# Altium schematic sheet FPGA&CODECS.SchDoc: {Наименование}
size 420 x 297 mm; DocumentNumber: ПЛАС.ХХХХХХ.ХХХ ХХ; SheetNumber: 8; SheetTotal: 11; PageSetup: Record=PageOptions|CenterHorizontal=False|CenterVertical=False|PrintScale=0.95|XCorrection=0.00|YCorrection=0.00|PrintKind=1|BorderSize=5000000|LeftOffset=0|BottomOffset=0|Orientation=1|PaperLength=1000|PaperWidth=1000|Scale=100|PaperSource=15|PrintQuality=600|MediaType=1|DitherType=10|PaperKind=A4|PrintScaleMode=1; Rule: PcbType=ProtelPcb
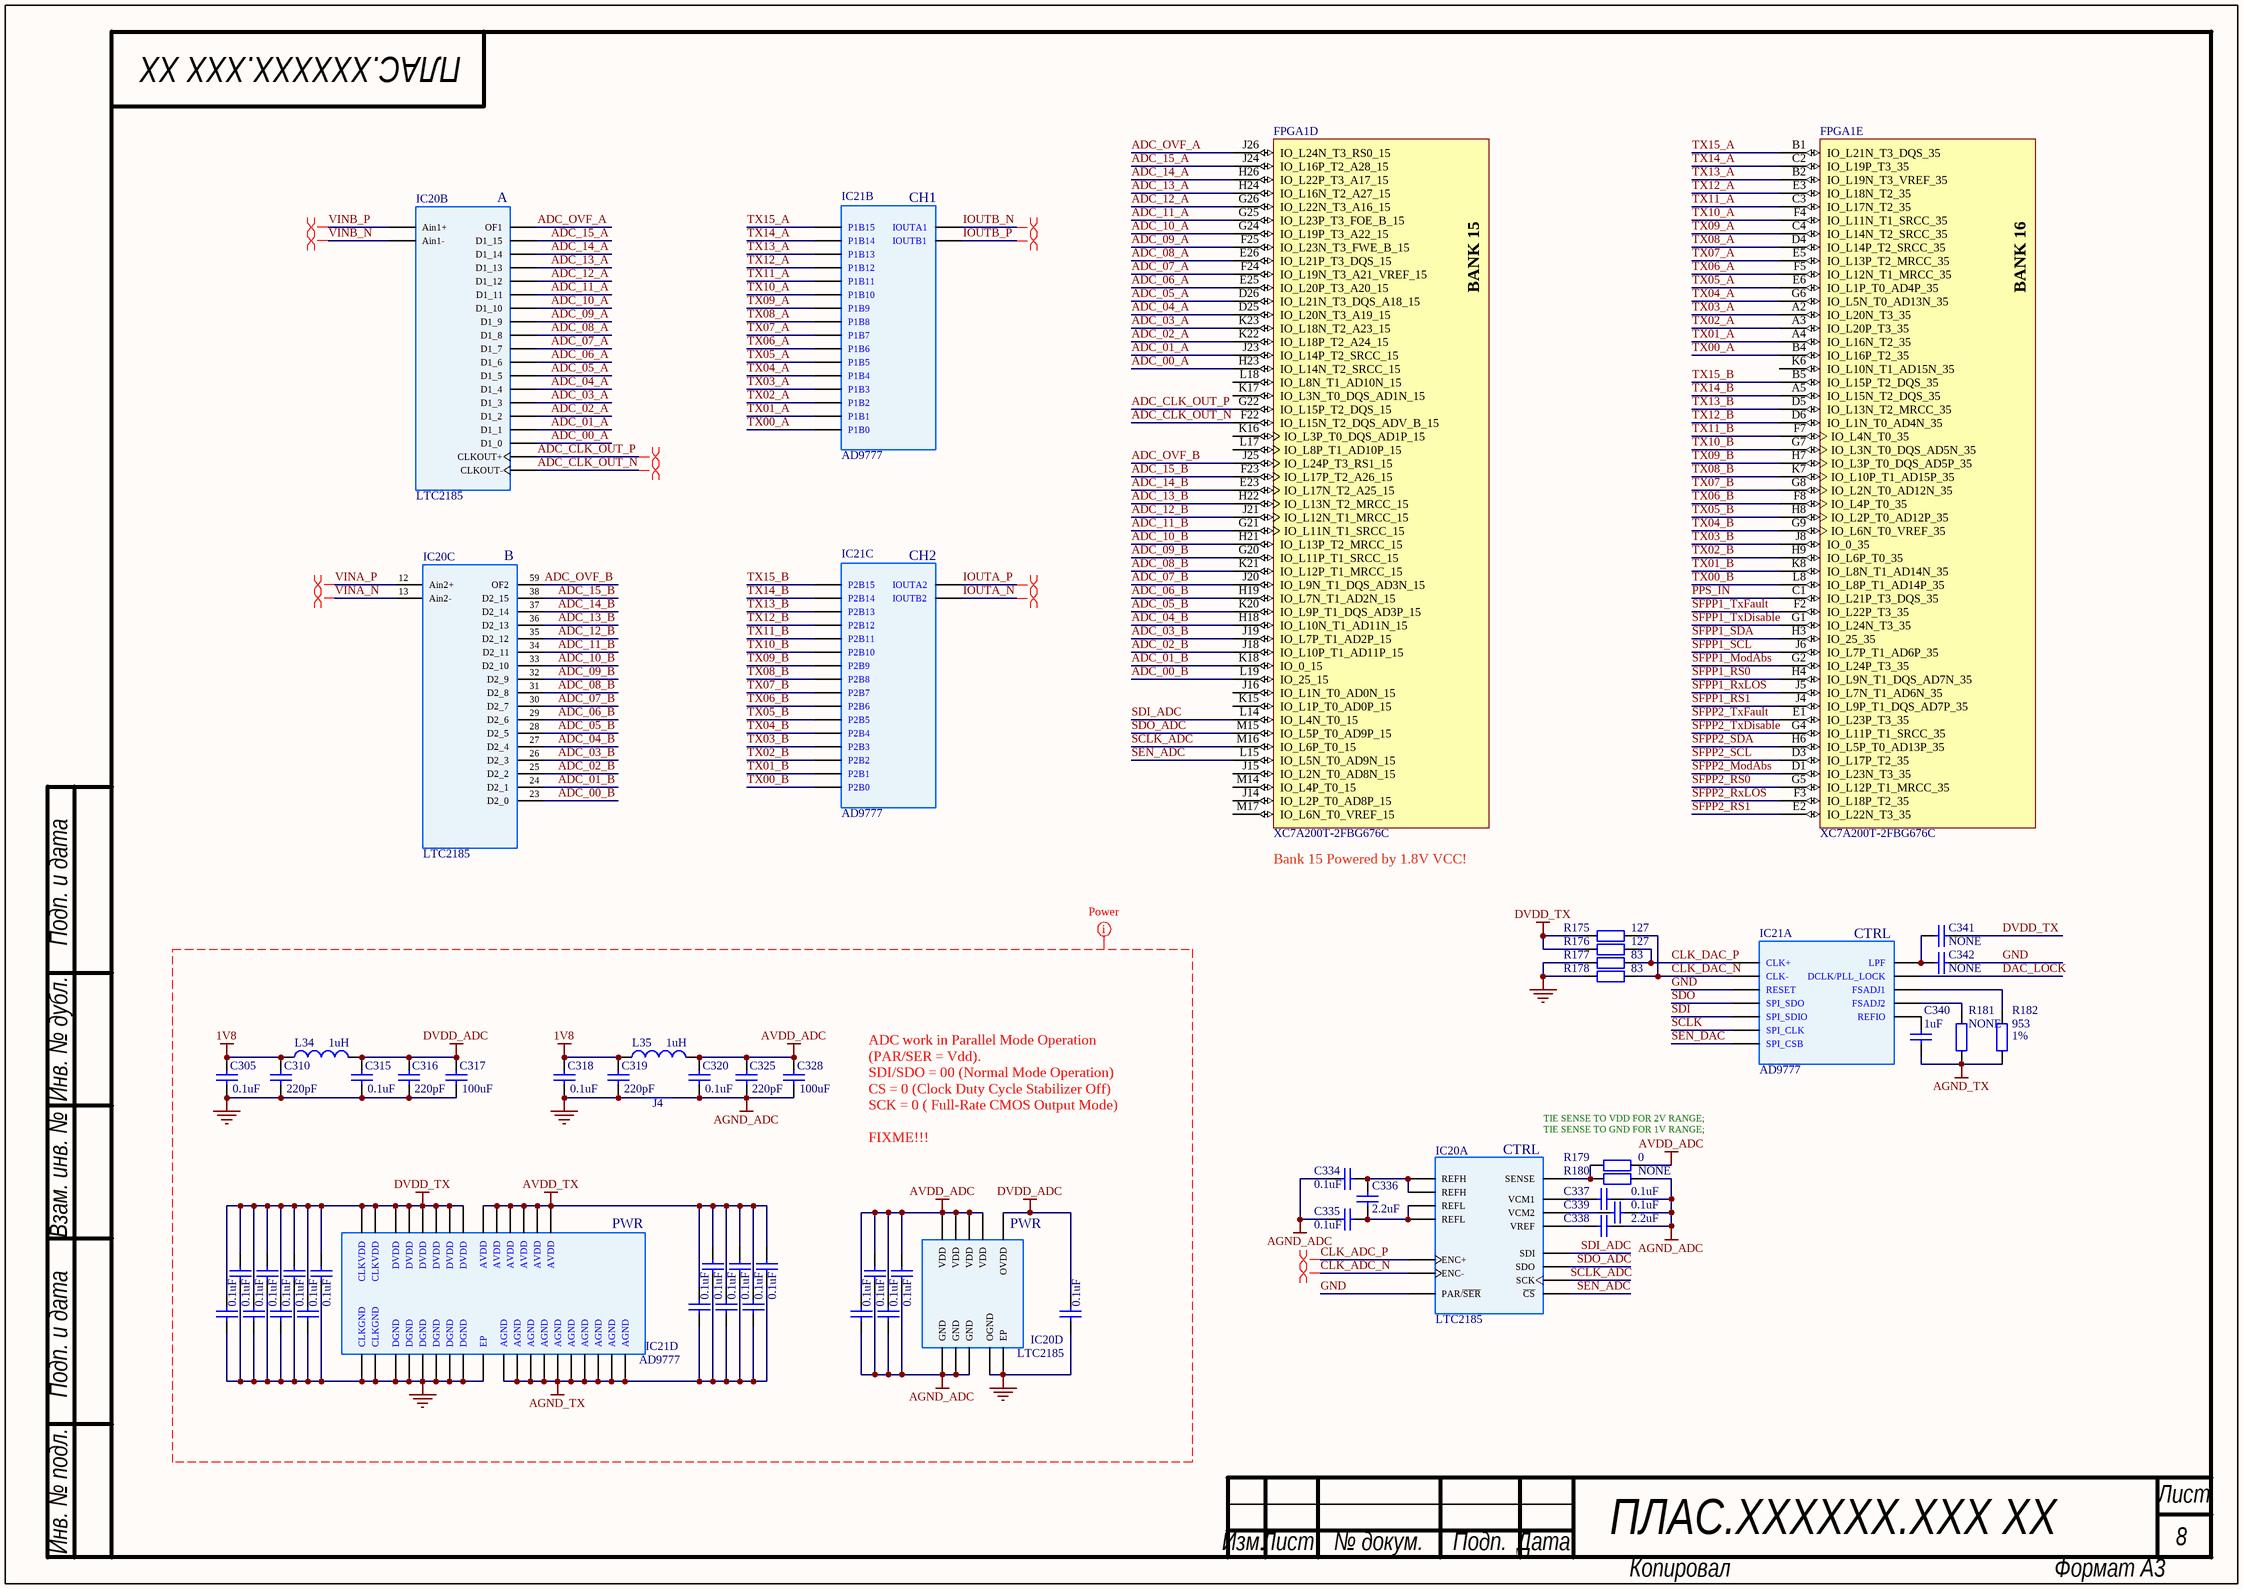
[diagram p0: FPGA&CODECS.SchDoc]

## Parts
C305  value 0.1uF  [C0603]  (hidden comment: Cap)
C306  value 0.1uF  [С0402]  (hidden comment: Cap)
C307  value 0.1uF  [С0402]  (hidden comment: Cap)
C308  value 0.1uF  [С0402]  (hidden comment: Cap)
C309  value 0.1uF  [С0402]  (hidden comment: Cap)
C310  value 220pF  [C0603]  (hidden comment: Cap)
C311  value 0.1uF  [С0402]  (hidden comment: Cap)
C312  value 0.1uF  [С0402]  (hidden comment: Cap)
C313  value 0.1uF  [С0402]  (hidden comment: Cap)
C314  value 0.1uF  [С0402]  (hidden comment: Cap)
C315  value 0.1uF  [C0603]  (hidden comment: Cap)
C316  value 220pF  [C0603]  (hidden comment: Cap)
C317  value 100uF  [C1210]  (hidden comment: Cap)
C318  value 0.1uF  [C0603]  (hidden comment: Cap)
C319  value 220pF  [C0603]  (hidden comment: Cap)
C320  value 0.1uF  [C0603]  (hidden comment: Cap)
C321  value 0.1uF  [С0402]  (hidden comment: Cap)
C322  value 0.1uF  [С0402]  (hidden comment: Cap)
C323  value 0.1uF  [С0402]  (hidden comment: Cap)
C324  value 0.1uF  [С0402]  (hidden comment: Cap)
C325  value 220pF  [C0603]  (hidden comment: Cap)
C326  value 0.1uF  [С0402]  (hidden comment: Cap)
C327  value 0.1uF  [С0402]  (hidden comment: Cap)
C328  value 100uF  [C1210]  (hidden comment: Cap)
C329  value 0.1uF  [С0402]  (hidden comment: Cap)
C330  value 0.1uF  [С0402]  (hidden comment: Cap)
C331  value 0.1uF  [С0402]  (hidden comment: Cap)
C332  value 0.1uF  [С0402]  (hidden comment: Cap)
C333  value 0.1uF  [С0402]  (hidden comment: Cap)
C334  value 0.1uF  [С0402]  (hidden comment: Cap)
C335  value 0.1uF  [С0402]  (hidden comment: Cap)
C336  value 2.2uF  [C0603]  (hidden comment: Cap)
C337  value 0.1uF  [С0402]  (hidden comment: Cap)
C338  value 2.2uF  [C0603]  (hidden comment: Cap)
C339  value 0.1uF  [С0402]  (hidden comment: Cap)
C340  value 1uF  [С0402]  (hidden comment: Cap)
C341  value NONE  [С0402]  (hidden comment: Cap)
C342  value NONE  [С0402]  (hidden comment: Cap)
FPGA1  XC7A200T-2FBG676C  [FGG676]  (parts D,E of 14)
IC20  LTC2185  [QFN-64]  (parts A,B,C,D of 4)
IC21  AD9777  [TQFP-80-EP]  (parts A,B,C,D of 4)
J4  JMP  [JUMPER]  (value not drawn)  (net tie, no BOM)
L34  value 1uH  [L1210_Murata LQH]  (hidden comment: Inductor_LF)
L35  value 1uH  [L1210_Murata LQH]  (hidden comment: Inductor_LF)
R175  value 127  [R0402]  (hidden comment: Res)
R176  value 127  [R0402]  (hidden comment: Res)
R177  value 83  [R0402]  (hidden comment: Res)
R178  value 83  [R0402]  (hidden comment: Res)
R179  value 0  [R0402]  (hidden comment: Res)
R180  value NONE  [R0402]  (hidden comment: Res)
R181  value NONE  [R0402]  (hidden comment: Res)
R182  value 953  Tolerance: 1%  [R0402]  (hidden comment: Res)

## Nets
1V8: C305.1 C310.1 C318.1 C319.1 L34.2 L35.1
AGND_ADC: C320.2 C325.2 C328.2 C329.1 C330.1 C331.1 C332.1 C334.1 C335.2 C337.2 C338.1 C339.1 IC20.3(GND) IC20.6(GND) IC20.14(GND) J4.2 R180.2
AGND_TX: C321.1 C322.1 C323.1 C324.1 C326.1 C327.1 C340.2 IC21.62(AGND) IC21.64(AGND) IC21.66(AGND) IC21.67(AGND) IC21.70(AGND) IC21.71(AGND) IC21.74(AGND) IC21.75(AGND) IC21.77(AGND) IC21.79(AGND) R181.2 R182.2
AVDD_ADC: C320.1 C325.1 C328.1 C329.2 C330.2 C331.2 C332.2 IC20.1(VDD) IC20.16(VDD) IC20.17(VDD) IC20.64(VDD) L35.2 R179.1
AVDD_TX: C321.2 C322.2 C323.2 C324.2 C326.2 C327.2 IC21.61(AVDD) IC21.63(AVDD) IC21.65(AVDD) IC21.76(AVDD) IC21.78(AVDD) IC21.80(AVDD)
DVDD_ADC: C315.1 C316.1 C317.1 C333.2 IC20.42(OVDD) L34.1
DVDD_TX: C306.2 C307.2 C308.2 C309.2 C311.2 C312.1 C313.2 C314.1 C341.2 IC21.1(CLKVDD) IC21.3(CLKVDD) IC21.10(DVDD) IC21.18(DVDD) IC21.26(DVDD) IC21.36(DVDD) IC21.43(DVDD) IC21.51(DVDD) R175.2 R176.2
GND: C305.2 C306.1 C307.1 C308.1 C309.1 C310.2 C311.1 C312.2 C313.1 C314.2 C315.2 C316.2 C317.2 C318.2 C319.2 C333.1 C342.1 IC20.0(EP) IC20.11(PAR/~{SER}) IC20.41(OGND) IC21.0(EP) IC21.4(CLKGND) IC21.7(CLKGND) IC21.9(DGND) IC21.17(DGND) IC21.25(DGND) IC21.35(DGND) IC21.44(DGND) IC21.52(DGND) IC21.57(RESET) J4.1 R177.2 R178.2
ADC_00_A: FPGA1.H23(IO_L14N_T2_SRCC_15) IC20.43(D1_0)
ADC_00_B: FPGA1.L19(IO_25_15) IC20.23(D2_0)
ADC_01_A: FPGA1.J23(IO_L14P_T2_SRCC_15) IC20.44(D1_1)
ADC_01_B: FPGA1.K18(IO_0_15) IC20.24(D2_1)
ADC_02_A: FPGA1.K22(IO_L18P_T2_A24_15) IC20.45(D1_2)
ADC_02_B: FPGA1.J18(IO_L10P_T1_AD11P_15) IC20.25(D2_2)
ADC_03_A: FPGA1.K23(IO_L18N_T2_A23_15) IC20.46(D1_3)
ADC_03_B: FPGA1.J19(IO_L7P_T1_AD2P_15) IC20.26(D2_3)
ADC_04_A: FPGA1.D25(IO_L20N_T3_A19_15) IC20.47(D1_4)
ADC_04_B: FPGA1.H18(IO_L10N_T1_AD11N_15) IC20.27(D2_4)
ADC_05_A: FPGA1.D26(IO_L21N_T3_DQS_A18_15) IC20.48(D1_5)
ADC_05_B: FPGA1.K20(IO_L9P_T1_DQS_AD3P_15) IC20.28(D2_5)
ADC_06_A: FPGA1.E25(IO_L20P_T3_A20_15) IC20.49(D1_6)
ADC_06_B: FPGA1.H19(IO_L7N_T1_AD2N_15) IC20.29(D2_6)
ADC_07_A: FPGA1.F24(IO_L19N_T3_A21_VREF_15) IC20.50(D1_7)
ADC_07_B: FPGA1.J20(IO_L9N_T1_DQS_AD3N_15) IC20.30(D2_7)
ADC_08_A: FPGA1.E26(IO_L21P_T3_DQS_15) IC20.51(D1_8)
ADC_08_B: FPGA1.K21(IO_L12P_T1_MRCC_15) IC20.31(D2_8)
ADC_09_A: FPGA1.F25(IO_L23N_T3_FWE_B_15) IC20.52(D1_9)
ADC_09_B: FPGA1.G20(IO_L11P_T1_SRCC_15) IC20.32(D2_9)
ADC_10_A: FPGA1.G24(IO_L19P_T3_A22_15) IC20.53(D1_10)
ADC_10_B: FPGA1.H21(IO_L13P_T2_MRCC_15) IC20.33(D2_10)
ADC_11_A: FPGA1.G25(IO_L23P_T3_FOE_B_15) IC20.54(D1_11)
ADC_11_B: FPGA1.G21(IO_L11N_T1_SRCC_15) IC20.34(D2_11)
ADC_12_A: FPGA1.G26(IO_L22N_T3_A16_15) IC20.55(D1_12)
ADC_12_B: FPGA1.J21(IO_L12N_T1_MRCC_15) IC20.35(D2_12)
ADC_13_A: FPGA1.H24(IO_L16N_T2_A27_15) IC20.56(D1_13)
ADC_13_B: FPGA1.H22(IO_L13N_T2_MRCC_15) IC20.36(D2_13)
ADC_14_A: FPGA1.H26(IO_L22P_T3_A17_15) IC20.57(D1_14)
ADC_14_B: FPGA1.E23(IO_L17N_T2_A25_15) IC20.37(D2_14)
ADC_15_A: FPGA1.J24(IO_L16P_T2_A28_15) IC20.58(D1_15)
ADC_15_B: FPGA1.F23(IO_L17P_T2_A26_15) IC20.38(D2_15)
ADC_CLK_OUT_N: FPGA1.F22(IO_L15N_T2_DQS_ADV_B_15) IC20.39(CLKOUT-)
ADC_CLK_OUT_P: FPGA1.G22(IO_L15P_T2_DQS_15) IC20.40(CLKOUT+)
ADC_OVF_A: FPGA1.J26(IO_L24N_T3_RS0_15) IC20.60(OF1)
ADC_OVF_B: FPGA1.J25(IO_L24P_T3_RS1_15) IC20.59(OF2)
CLK_ADC_N: IC20.19(ENC-)
CLK_ADC_P: IC20.18(ENC+)
CLK_DAC_N: IC21.6(CLK-) R175.1 R178.1
CLK_DAC_P: IC21.5(CLK+) R176.1 R177.1
DAC_LOCK: IC21.8(DCLK/PLL_LOCK)
IOUTA_N: IC21.68(IOUTB2)
IOUTA_P: IC21.69(IOUTA2)
IOUTB_N: IC21.73(IOUTA1)
IOUTB_P: IC21.72(IOUTB1)
PPS_IN: FPGA1.C1(IO_L21P_T3_DQS_35)
SCLK: IC21.55(SPI_CLK)
SCLK_ADC: FPGA1.M16(IO_L6P_T0_15) IC20.21(SCK)
SDI: IC21.54(SPI_SDIO)
SDI_ADC: FPGA1.L14(IO_L4N_T0_15) IC20.22(SDI)
SDO: IC21.53(SPI_SDO)
SDO_ADC: FPGA1.M15(IO_L5P_T0_AD9P_15) IC20.61(SDO)
SEN_ADC: FPGA1.L15(IO_L5N_T0_AD9N_15) IC20.20(~{CS})
SEN_DAC: IC21.56(SPI_CSB)
SFPP1_ModAbs: FPGA1.G2(IO_L24P_T3_35)
SFPP1_RS0: FPGA1.H4(IO_L9N_T1_DQS_AD7N_35)
SFPP1_RS1: FPGA1.J4(IO_L9P_T1_DQS_AD7P_35)
SFPP1_RxLOS: FPGA1.J5(IO_L7N_T1_AD6N_35)
SFPP1_SCL: FPGA1.J6(IO_L7P_T1_AD6P_35)
SFPP1_SDA: FPGA1.H3(IO_25_35)
SFPP1_TxDisable: FPGA1.G1(IO_L24N_T3_35)
SFPP1_TxFault: FPGA1.F2(IO_L22P_T3_35)
SFPP2_ModAbs: FPGA1.D1(IO_L23N_T3_35)
SFPP2_RS0: FPGA1.G5(IO_L12P_T1_MRCC_35)
SFPP2_RS1: FPGA1.E2(IO_L22N_T3_35)
SFPP2_RxLOS: FPGA1.F3(IO_L18P_T2_35)
SFPP2_SCL: FPGA1.D3(IO_L17P_T2_35)
SFPP2_SDA: FPGA1.H6(IO_L5P_T0_AD13P_35)
SFPP2_TxDisable: FPGA1.G4(IO_L11P_T1_SRCC_35)
SFPP2_TxFault: FPGA1.E1(IO_L23P_T3_35)
TX00_A: FPGA1.B4(IO_L16P_T2_35) IC21.30(P1B0)
TX00_B: FPGA1.L8(IO_L8P_T1_AD14P_35) IC21.50(P2B0)
TX01_A: FPGA1.A4(IO_L16N_T2_35) IC21.29(P1B1)
TX01_B: FPGA1.K8(IO_L8N_T1_AD14N_35) IC21.49(P2B1)
TX02_A: FPGA1.A3(IO_L20P_T3_35) IC21.28(P1B2)
TX02_B: FPGA1.H9(IO_L6P_T0_35) IC21.48(P2B2)
TX03_A: FPGA1.A2(IO_L20N_T3_35) IC21.27(P1B3)
TX03_B: FPGA1.J8(IO_0_35) IC21.47(P2B3)
TX04_A: FPGA1.G6(IO_L5N_T0_AD13N_35) IC21.24(P1B4)
TX04_B: FPGA1.G9(IO_L6N_T0_VREF_35) IC21.46(P2B4)
TX05_A: FPGA1.E6(IO_L1P_T0_AD4P_35) IC21.23(P1B5)
TX05_B: FPGA1.H8(IO_L2P_T0_AD12P_35) IC21.45(P2B5)
TX06_A: FPGA1.F5(IO_L12N_T1_MRCC_35) IC21.22(P1B6)
TX06_B: FPGA1.F8(IO_L4P_T0_35) IC21.42(P2B6)
TX07_A: FPGA1.E5(IO_L13P_T2_MRCC_35) IC21.21(P1B7)
TX07_B: FPGA1.G8(IO_L2N_T0_AD12N_35) IC21.41(P2B7)
TX08_A: FPGA1.D4(IO_L14P_T2_SRCC_35) IC21.20(P1B8)
TX08_B: FPGA1.K7(IO_L10P_T1_AD15P_35) IC21.40(P2B8)
TX09_A: FPGA1.C4(IO_L14N_T2_SRCC_35) IC21.19(P1B9)
TX09_B: FPGA1.H7(IO_L3P_T0_DQS_AD5P_35) IC21.39(P2B9)
TX10_A: FPGA1.F4(IO_L11N_T1_SRCC_35) IC21.16(P1B10)
TX10_B: FPGA1.G7(IO_L3N_T0_DQS_AD5N_35) IC21.38(P2B10)
TX11_A: FPGA1.C3(IO_L17N_T2_35) IC21.15(P1B11)
TX11_B: FPGA1.F7(IO_L4N_T0_35) IC21.37(P2B11)
TX12_A: FPGA1.E3(IO_L18N_T2_35) IC21.14(P1B12)
TX12_B: FPGA1.D6(IO_L1N_T0_AD4N_35) IC21.34(P2B12)
TX13_A: FPGA1.B2(IO_L19N_T3_VREF_35) IC21.13(P1B13)
TX13_B: FPGA1.D5(IO_L13N_T2_MRCC_35) IC21.33(P2B13)
TX14_A: FPGA1.C2(IO_L19P_T3_35) IC21.12(P1B14)
TX14_B: FPGA1.A5(IO_L15N_T2_DQS_35) IC21.32(P2B14)
TX15_A: FPGA1.B1(IO_L21N_T3_DQS_35) IC21.11(P1B15)
TX15_B: FPGA1.B5(IO_L15P_T2_DQS_35) IC21.31(P2B15)
VINA_N: IC20.13(Ain2-)
VINA_P: IC20.12(Ain2+)
VINB_N: IC20.5(Ain1-)
VINB_P: IC20.4(Ain1+)
NetC334_2: C334.2 C336.1 IC20.7(REFH) IC20.9(REFH)
NetC335_1: C335.1 C336.2 IC20.8(REFL) IC20.10(REFL)
NetC337_1: C337.1 IC20.2(VCM1)
NetC338_2: C338.2 IC20.62(VREF)
NetC339_2: C339.2 IC20.15(VCM2)
NetC340_1: C340.1 IC21.58(REFIO)
NetC341_1: C341.1 C342.2 IC21.2(LPF)
NetIC20_63: IC20.63(SENSE) R179.2 R180.1
NetIC21_59: IC21.59(FSADJ2) R181.1
NetIC21_60: IC21.60(FSADJ1) R182.1

Not connected (* = marked no-connect by the designer): FPGA1 J14(IO_L2P_T0_AD8P_15) J15(IO_L2N_T0_AD8N_15) J16(IO_L1N_T0_AD0N_15) K6(IO_L10N_T1_AD15N_35) K15(IO_L1P_T0_AD0P_15) K16(IO_L3P_T0_DQS_AD1P_15) K17(IO_L3N_T0_DQS_AD1N_15) L17(IO_L8P_T1_AD10P_15) L18(IO_L8N_T1_AD10N_15) M14(IO_L4P_T0_15) M17(IO_L6N_T0_VREF_15)

## Layout directives
net class Power: 1V8, AGND_ADC, AGND_TX, AVDD_ADC, AVDD_TX, DVDD_ADC, DVDD_TX, GND
differential pair: ADC_CLK_OUT_N, ADC_CLK_OUT_P, CLK_ADC_N, CLK_ADC_P, IOUTA_N, IOUTA_P, IOUTB_N, IOUTB_P, VINA_N, VINA_P, VINB_N, VINB_P

## Notes on the sheet
- (near FPGA1) Bank 15 Powered by 1.8V VCC!
- TIE SENSE TO VDD FOR 2V RANGE;
  TIE SENSE TO GND FOR 1V RANGE;
- ADC work in Parallel Mode Operation (PAR/SER = Vdd).
  SDI/SDO = 00 (Normal Mode Operation)
  CS = 0 (Clock Duty Cycle Stabilizer Off)
  SCK = 0 ( Full-Rate CMOS Output Mode)
  FIXME!!!
- Подп. и дата
- Инв. № дубл.
- Взам. инв. №
- Инв. № подл.
- Лист
- Изм.
- № докум.
- Подп.
- Дата
- Копировал
- Формат А3
- (in symbol AD9777, part A) CTRL
- (in symbol AD9777, part B) CH1
- (in symbol AD9777, part C) CH2
- (in symbol AD9777, part D) PWR
- (in symbol LTC2185, part A) CTRL
- (in symbol LTC2185, part B) A
- (in symbol LTC2185, part C) B
- (in symbol LTC2185, part D) PWR
- (in symbol XC7A200T-2FBG676C, part D) BANK 15
- (in symbol XC7A200T-2FBG676C, part E) BANK 16

## Library data of the parts
C305 C310 C315 C316 C318-C320 C325 = Cer Cap: Cer Cap Small; Manufacturer: Murata; Material: x5r; Voltage: 16V; Tolerance: 10%; Type: Ceramic; PackageReference: SMD Chip Capacitor; Package: 0603
C306-C309 C311-C314 C321-C324 C326 C327 C329-C335 C337 C339 C341 C342 = Cer Cap: Cer Cap Small; Manufacturer: Murata; Material: x7r; Voltage: 50V; Tolerance: 10%; Type: Ceramic; PackageReference: SMD Chip Capacitor; Package: 0402
C317 C328 = Cap uF: Cer Cap Large; Manufacturer: Murata; Material: x5r; Tolerance: 20%; Voltage: 6.3V; Type: Ceramic; Package: C1210; PackageDescription: SMD Chip Capacitor
C336 C338 = Cer Cap: Cer Cap Small; Manufacturer: Murata; Material: x7r; Voltage: 10V; Tolerance: 10%; Type: Ceramic; PackageReference: SMD Chip Capacitor; Package: 0402
C340 = Cer Cap: Cer Cap Small; Manufacturer: Murata; Material: x7r; Voltage: 16V; Tolerance: 10%; Type: Ceramic; PackageReference: SMD Chip Capacitor; Package: 0402
FPGA1 = XC7A200T-2FBG676C: Artix-7 FPGA, 400 User I/Os, 8 GTP, 676-Ball BGA, Speed Grade 2, Commercial Grade, Pb-Free; Manufacturer: Xilinx; Block RAM Blocks (18Kb): 730; Block RAM Blocks (36Kb): 365; Block RAM Blocks (Max Kb): 13140; CLBs (Slices): 33650; Clock Mgmt Tiles (CMTs): 10; DSP48E1 Slices: 740; Logic Cells: 215360; Max User I/O: 500; Speed Grade: -2; DatasheetVersion: v1.12; PackageVersion: Rev 1.8; PackageReference: FBG676; PackageDescription: Flip-Chip Lidless BGA, Body 27 x 27 mm, 1.0 mm Pitch; Supplier 1: Digi-Key; Supplier Part Number 1: 122-1865-ND; CLBs (Max Distributed RAM Kb): 2888; Generic Part Number: XC7A200T; RoHS: Pb-Free; NexusDeviceID: XC7A200T-2FBG676C; Mounting Technology: Surface Mount; Code_JEDEC: MS-034; PartNumber: XC7A200T-2FBG676C; ComponentLink1Description: Manufacturer URL; ComponentLink1URL: http://www.xilinx.com/; ComponentLink2Description: Datasheet; ComponentLink2URL: http://www.xilinx.com/support/documentation/data_sheets/ds180_7Series_Overview.pdf; ComponentLink3Description: Package Specification; ComponentLink3URL: http://www.xilinx.com/support/documentation/user_guides/ug475_7Series_Pkg_Pinout.pdf; ComponentLink4Description: DC and Switching Characteristics; ComponentLink4URL: http://www.xilinx.com/support/documentation/data_sheets/ds181_Artix_7_Data_Sheet.pdf; ComponentLink5Description: Package File; ComponentLink5URL: http://www.xilinx.com/support/packagefiles/a7packages/xc7a200tfbg676pkg.txt; ComponentLink6Description: Packaging and Pinout; ComponentLink6URL: http://www.xilinx.com/support/documentation/user_guides/ug475_7Series_Pkg_Pinout.pdf
IC20 = LTC2185: Dual 16-Bit, 125Msps  Low Power 3V ADC; Name: LTC2185CUP#PBF-ND; Power Dissipation: 370mW; Voltage: Single 1.8V Supply; Resolution: 16 Bits; Sampling Frequency: 125 MHz; Type: Dual 16-Bit, 105Msps  Low Power 3V ADC; Temperature Range: 0°C to 70°C; Package: 64-Pin (9mm × 9mm) QFN
IC21 = AD9777: 16-Bit, 160 MSPS  D/A Converter; Name: AD9777BSV; Power Dissipation: typical 1.2 W @ 3.3 V; Voltage: Single 3.3 V; Resolution: 16 bit; Sampling Frequency: 160 MHz; Type: 16-Bit, 160 MSPS 2x/4x/8x Interpolating Dual TxDAC+® D/A Converter; Temperature Range: −40°C to +85°C; Package: 80-pin TQFP
J4 = JMP: PGND & AGND Connect; Rule: UNIONINDEX{}0[]RULEKIND{}Width[]NETSCOPE{}AnyNet[]LAYERKIND{}SameLayer[]NAME{}Schematic Width Constraint[]MAXLIMIT{}59.0551mil[]MINLIMIT{}10mil[]PREFEREDWIDTH{}10mil[]MIDLAYER5_MAXWIDTH{}19.685mil[]MIDLAYER6_MAXWIDTH{}19.685mil[]MIDLAYER7_MAXWIDTH{}19.685mil[]MIDLAYER8_MAXWIDTH{}19.685mil[]MIDLAYER9_MAXWIDTH{}19.685mil[]MIDLAYER10_MAXWIDTH{}19.685mil[]MIDLAYER11_MAXWIDTH{}19.685mil[]MIDLAYER12_MAXWIDTH{}19.685mil[]MIDLAYER13_MAXWIDTH{}19.685mil[]MIDLAYER14_MAXWIDTH{}19.685mil[]MIDLAYER15_MAXWIDTH{}19.685mil[]MIDLAYER16_MAXWIDTH{}19.685mil[]MIDLAYER17_MAXWIDTH{}19.685mil[]MIDLAYER18_MAXWIDTH{}19.685mil[]MIDLAYER19_MAXWIDTH{}19.685mil[]MIDLAYER20_MAXWIDTH{}19.685mil[]MIDLAYER21_MAXWIDTH{}19.685mil[]MIDLAYER22_MAXWIDTH{}19.685mil[]MIDLAYER23_MAXWIDTH{}19.685mil[]MIDLAYER24_MAXWIDTH{}19.685mil[]MIDLAYER25_MAXWIDTH{}19.685mil[]MIDLAYER26_MAXWIDTH{}19.685mil[]MIDLAYER27_MAXWIDTH{}19.685mil[]MIDLAYER28_MAXWIDTH{}19.685mil[]MIDLAYER29_MAXWIDTH{}19.685mil[]MIDLAYER30_MAXWIDTH{}19.685mil[]MINIMP{}50.000000[]MAXIMP{}50.000000[]FAVIMP{}50.000000[]UNIT{}Metric[]PcbType{}ProtelPcb
L34 L35 = Inductor_LF: Inductor_Power_Lines; Manufacturer: Murata; Name: LQH32PN1R0NNC; Tolerance: 5%; Current: 2500mA; Frequency: 100MHz; Package: 1210; PackageDescription: Chip Inductor; Temperature Range: -25…85; Series: LQH
R175-R181 = Res: Resistor; Name: Chip SMD Resistor; Tolerance: 5%; Power: 0.062 Wt; Package: SMD; Temperature Range: -55…155
R182 = Res: Resistor; Name: Chip SMD Resistor; Power: 0.062 Wt; Package: SMD; Temperature Range: -55…155